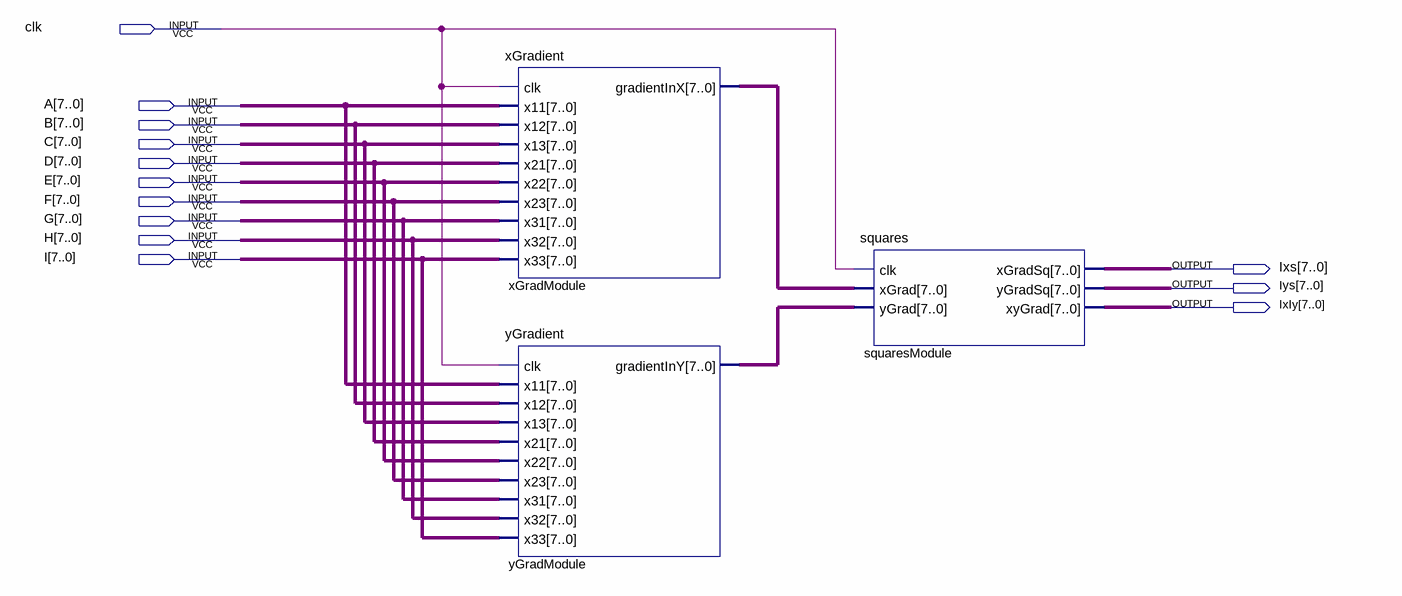
[diagram p0: schematic sheet]
// Quartus schematic operationOne.bdf as structural Verilog: 3 symbols, 13 pins
module operationOne (
  input  clk,
  input  [7:0] A,
  input  [7:0] B,
  input  [7:0] C,
  input  [7:0] D,
  input  [7:0] E,
  input  [7:0] F,
  input  [7:0] G,
  input  [7:0] H,
  input  [7:0] I,
  output [7:0] Ixs,
  output [7:0] Iys,
  output [7:0] IxIy
);

  wire [7:0] xGradModule_gradientinx, yGradModule_gradientiny;

  xGradient xGradModule (
    .clk(clk), .x11(A), .x12(B), .x13(C), .x21(D), .x22(E), .x23(F), .x31(G), .x32(H), .x33(I),
    .gradientInX(xGradModule_gradientinx));
  yGradient yGradModule (
    .clk(clk), .x11(A), .x12(B), .x13(C), .x21(D), .x22(E), .x23(F), .x31(G), .x32(H), .x33(I),
    .gradientInY(yGradModule_gradientiny));
  squares squaresModule (
    .clk(clk), .xGrad(xGradModule_gradientinx), .yGrad(yGradModule_gradientiny), .xGradSq(Ixs),
    .yGradSq(Iys), .xyGrad(IxIy));
endmodule
